# EAGLE design Plytka zasilacza (EAGLE 4.11)
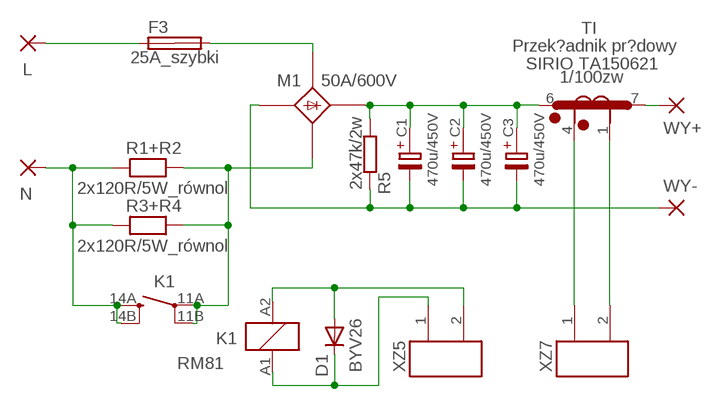
[diagram p0: schematic, sheet 1]

## Parts
C1  470u/450V  EB35D  [EB35D]
C2  470u/450V  EB35D  [EB35D]
C3  470u/450V  EB35D  [EB35D]
D1  BYV26  1N4148  [DO35-10]
F3  25A_szybki  SH32  [SH32]
K1  RM81  RP33  [RT-N/O16A5]
L  PAD-0820  [0820]
M1  50A/600V  B25A-  [B25A-]
N  PAD-0820  [0820]
R1+R2  2x120R/5W_równol  RPOWER5W  [RPOWER5W]
R3+R4  2x120R/5W_równol  RPOWER5W  [RPOWER5W]
R5  2x47k/2w  R-EU_0309/10  [0309/10]
TI  1/100zw  SIRIO  [SIRIO]
WY+  PAD-0820  [0820]
WY-  PAD  [25X5]
XZ5  ZK_2  [ZK_2]
XZ7  ZK_2  [ZK_2]

## Nets
N$1: D1.C K1.A1 XZ5.1
N$2: K1.14A(2:SA) K1.14B(2:SB) N.P$1(P) R1+R2.1 R3+R4.1
N$3: F3.2A M1.AC2-(AC2)
N$4: F3.1A L.P$1(P)
N$6: C1.+ C2.+ C3.+ M1.+1(+) R5.2 TI.6
N$7: C1.- C2.- C3.- M1.-1(-) R5.1 WY-.1(P)
N$8: TI.7 WY+.P$1(P)
N$9: D1.A K1.A2 XZ5.2
N$10: TI.4 XZ7.1
N$11: TI.1 XZ7.2
N$12: K1.11A(2:PA) K1.11B(2:PB) M1.AC1-(AC1) R1+R2.2 R3+R4.2
Unconnected: F3.1B F3.2B M1.+ M1.- M1.AC1 M1.AC2

## Notes on the sheet
- Przek?adnik pr?dowy
- SIRIO TA150621

## Library data of the parts
C1-C3 = elektrolity:EB35D
D1 = diode:1N4148: DIODE high speed (Philips)
F3 = fuse:SH32: FUSE HOLDER 6 x 32 mm, SH contact, SHH3N Schukat, 102071 Wickmann (Buerklin)
K1 = relay:RP?3*: Power PCB Relay RP II/1 SCHRACK 1 pole 16 A Source: http://www.schrack.com/.. 5834.pdf
L N WY+ WY- = dpads:PAD: WIRE PAD Standard US Drill Sizes and SMD pads
M1 = rectifier:B25A-: RECTIFIER 25-A bridge
R1+R2 R3+R4 = moje-elementy:RPOWER5W
R5 = rcl:R-EU_: RESISTOR, European symbol
TI = moje-elementy:SIRIO
XZ5 XZ7 = moje-elementy:ZK_2

## Board
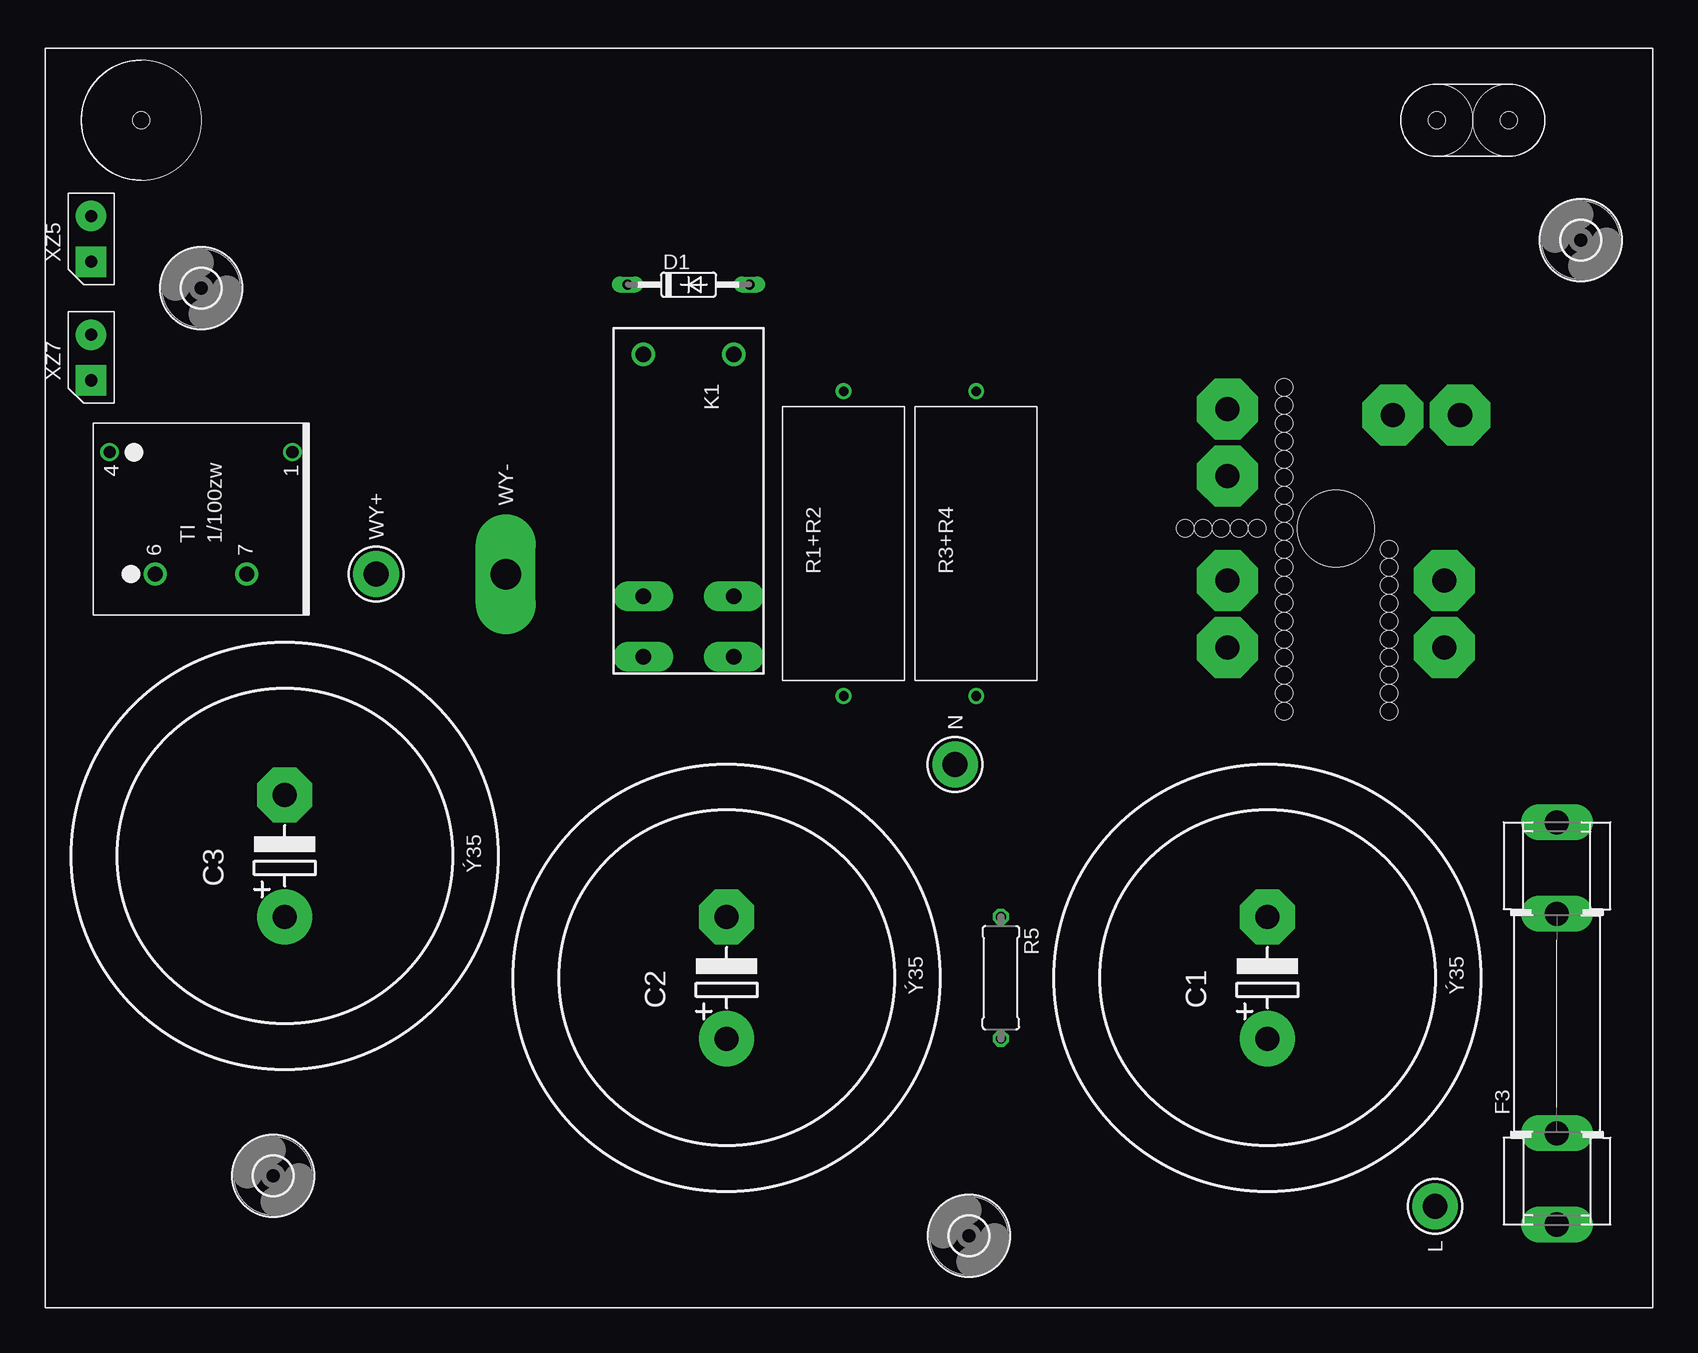
[diagram p1: board, top side]
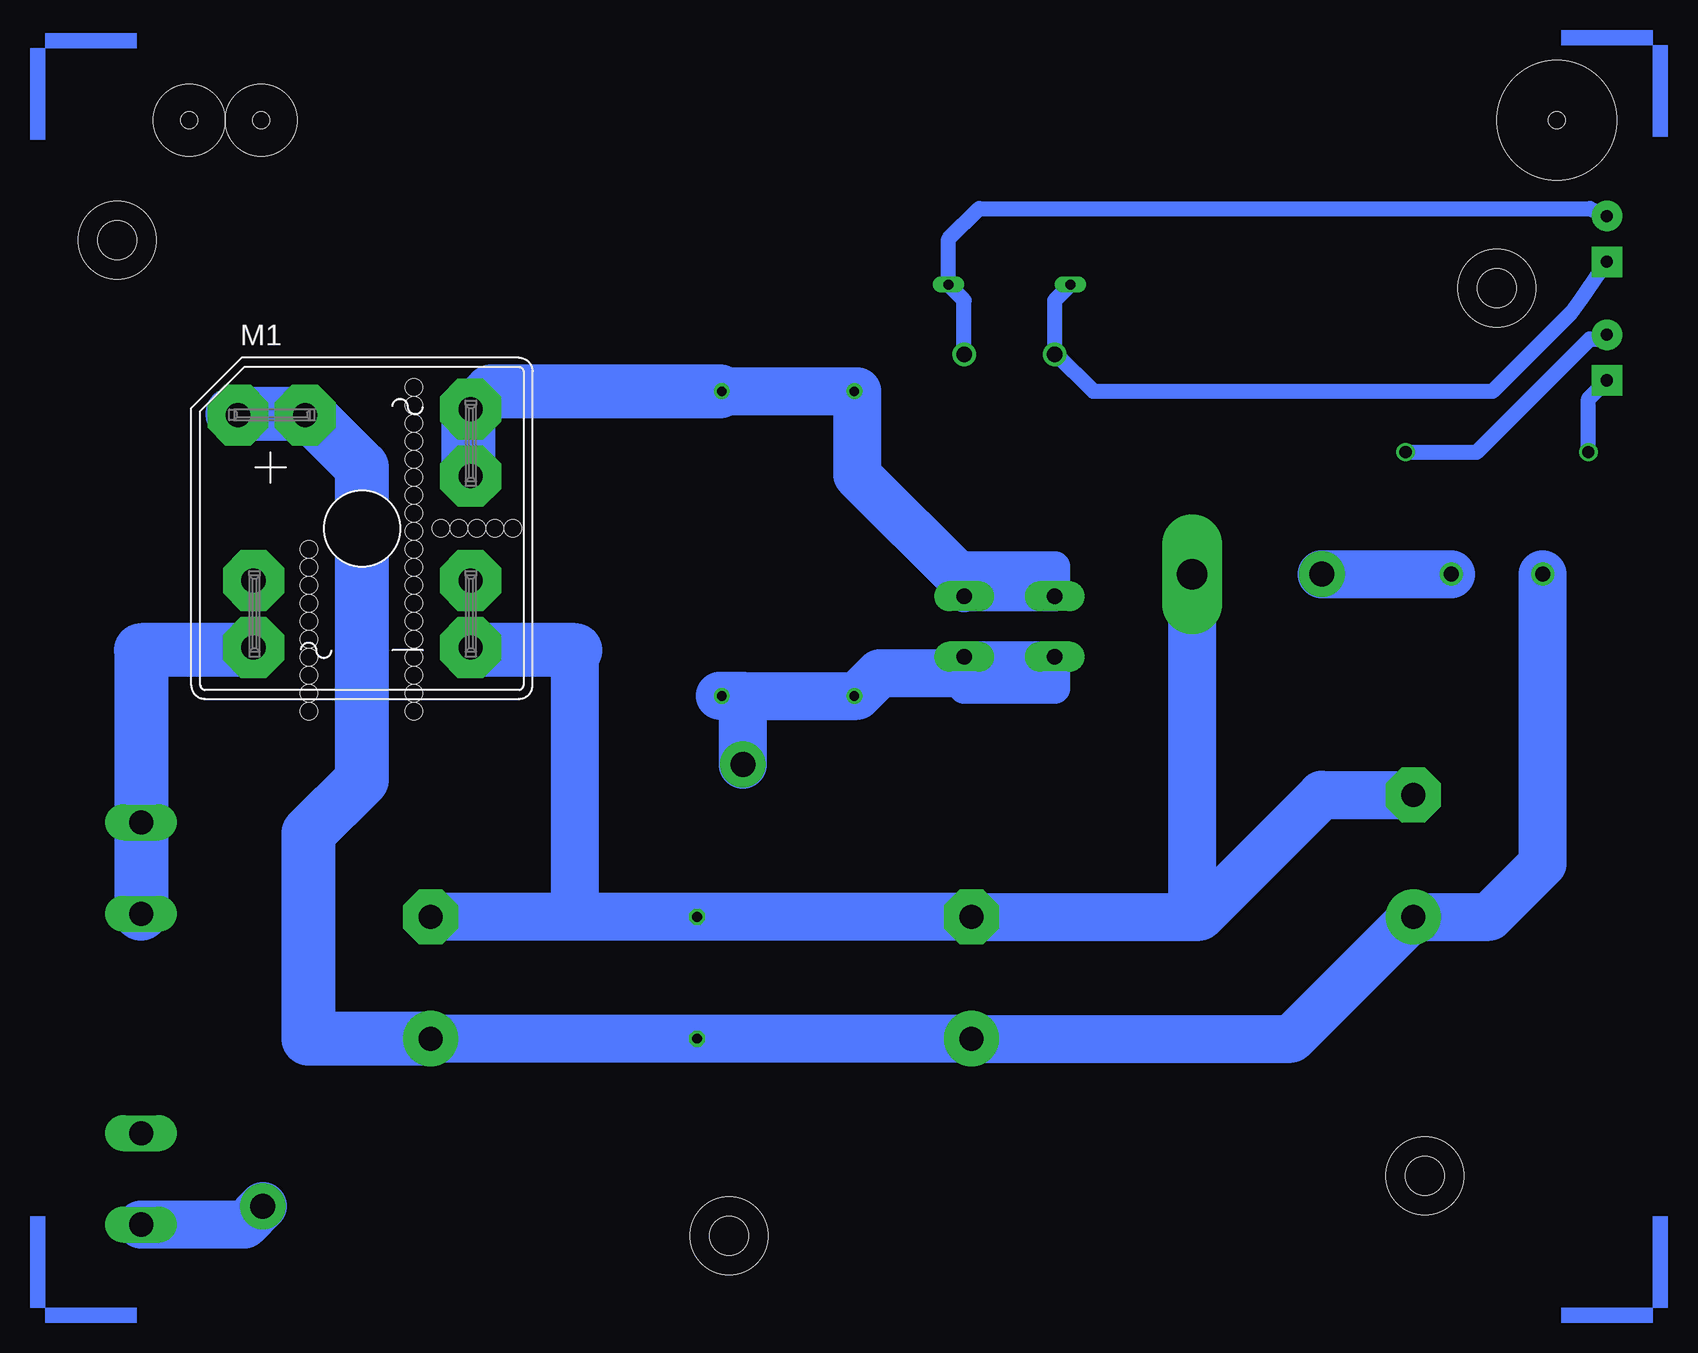
[diagram p2: board, bottom side, seen from below]

No outline drawn. Coordinates in mm, seen from the top.
Copper layers (1*16): Top 0.035mm / dielectric 1.5mm / Bottom 0.035mm
Design rules "default": minimum track width 10mil, minimum drill 24mil, track to track 8mil, track to pad 8mil, pad to pad 8mil, via to via 8mil, smd to smd 8mil, copper to edge 40mil, drill to drill 8mil, minimum pad ring 10mil, minimum via ring 8mil, stop-mask expansion 4mil, vias tented up to drill 0mil, thermal gap 10mil
Holes 6.45 mm at -6.27,-15.98 -57.27,-98.98 -115.27,-93.98 -121.27,-19.98
Holes 10 mm at -126.27,-5.98
Holes 1.42 mm at -126.27,-5.98 -18.27,-5.98 -12.27,-5.98 -31,-55.25 -31,-53.75 -31,-52.25 -31,-50.75 -31,-49.25 -31,-47.75 -31,-46.25 -31,-44.75 -31,-43.25 -31,-41.75 -31,-40.25 -31,-38.75 -31,-37.25 -31,-35.75 -31,-34.25 -31,-32.75 -31,-31.25 -31,-29.75 -31,-28.25 -22.25,-55.25 -22.25,-53.75 -22.25,-52.25 -22.25,-50.75 -22.25,-49.25 -22.25,-47.75 -22.25,-46.25 -22.25,-44.75 -22.25,-43.25 -22.25,-41.75 -39.25,-40 -37.75,-40 -36.25,-40 -34.75,-40 -33.25,-40
Holes 6 mm at -18.27,-5.98 -12.27,-5.98

### Footprints (pad centres in the part's own frame; a part is rotated, then mirrored left to right if it is on the bottom)
EB35D = drill 2.007 pad 4.597 round: + -5.08,0 | drill 2.007 pad 4.597 octagon: - 5.08,0
DO35-10 = drill 0.813 long: A 5.08,0; C -5.08,0
SH32 = drill 2.007 long: 1A -16.764,0; 1B -9.144,0; 2A 9.144,0; 2B 16.764,0
RT-N/O16A5 = drill 1.3 pad 2.5 long: 11A 7.56,3.78; 11B 7.56,-3.78; 14A 12.6,3.78; 14B 12.6,-3.78 | drill 1.3 round: A1 -12.6,-3.78; A2 -12.6,3.78
0820 = drill 2.083 pad 3.81 round: P$1 0,0
B25A- = drill 2.007 pad 5.08 octagon: + -10.338,9.449; +1 -4.75,9.449; - 9.042,-4.343; -1 9.042,-9.931; AC1 9.042,4.343; AC1- 9.042,9.931; AC2 -9.042,-4.343; AC2- -9.042,-9.931 | hole 6.401: 0,0
RPOWER5W = drill 0.813 round: 1 -12.7,0; 2 12.7,0
0309/10 = drill 0.813 octagon: 1 -5.08,0; 2 5.08,0
SIRIO = drill 1.016 round: 1 5.08,-7.62; 4 5.08,7.62 | drill 1.27 round: 6 -5.08,3.81; 7 -5.08,-3.81
3,2 = hole 3.2: 0,0
25X5 = drill 2.54 pad 5 long: 1 0,0
ZK_2 = drill 1.016 pad 2.54 square: 1 -3.81,0 | drill 1.016 pad 2.54 round: 2 0,0

### Placement (x,y rotation side)
C1  -32.38,-77.47 90 top
C2  -77.47,-77.47 90 top
C3  -114.3,-67.31 90 top
D1  -80.64,-19.68 0 top
F3  -8.26,-81.28 90 top
K1  -80.64,-38.1 270 top
L  -18.41,-96.52 270 top
M1  -26.67,-40.01 0 bottom
N  -58.42,-59.69 90 top
R1+R2  -67.72,-41.27 90 top
R3+R4  -56.67,-41.27 90 top
R5  -54.61,-77.47 270 top
TI  -121.28,-38.73 90 top
U$2  [3,2]  -115.27,-93.98 90 top
U$3  [3,2]  -57.27,-98.98 90 top
U$4  [3,2]  -6.27,-15.98 90 top
U$5  [3,2]  -121.27,-19.98 90 top
U$6  [ANGLE-ARROW-NW1]  -134.27,-104.98 90 top
U$7  [ANGLE-ARROW-NW1]  -134.27,0.27 0 top
U$8  [ANGLE-ARROW-NW1]  -0.27,0.02 270 top
U$9  [ANGLE-ARROW-NW1]  -0.27,-104.98 180 top
WY+  -106.68,-43.81 90 top
WY-  -95.89,-43.81 90 top
XZ5  -130.44,-13.97 90 top
XZ7  -130.44,-23.86 90 top

### Tracks (layer width: path | path; a pad name or v marks a point on that pad's centre or on a via)
N$1
  Bottom 1.27: K1.A1 -84.42,-25.4 | -84.42,-25.4 -84.42,-20.98 D1.C | XZ5.1 -128.27,-20.95 -127.52,-21.98 -120.92,-28.57 -87.63,-28.57 -84.45,-25.4 -84.42,-25.4
N$2
  Bottom 2.54: -76.86,-50.77 -76.83,-50.8 | -76.86,-50.77 K1.14A -76.86,-53.34 | K1.14B -76.94,-50.7 -76.86,-50.77 | -76.86,-53.34 -76.83,-53.34 | -76.86,-53.34 -84.45,-53.34 -84.45,-52.07 | -84.45,-52.07 -84.45,-50.8 | -76.83,-52.07 -84.45,-52.07
  Bottom 4: -76.83,-52.07 -69.85,-52.07 -67.94,-53.98 R1+R2.1 -58.42,-53.98 | -56.52,-53.98 R3+R4.1 -58.42,-53.98 | N.P$1 -58.42,-53.98
N$3
  Bottom 4.5: -17.78,-50.16 -17.63,-50.16 | -17.63,-50.16 M1.AC2- | F3.2A -8.26,-50.16 -17.63,-50.16
N$4
  Bottom 4: F3.1A -16.89,-98.04 L.P$1
N$6
  Bottom 4: C1.+ R5.2 C2.+ -104.14,-82.55 C3.+ -120.65,-72.39 -125.09,-67.94 TI.6
  Bottom 4.5: -21.92,-30.48 M1.+1 | -21.92,-30.48 -15.88,-30.48 | -21.92,-30.48 -22.23,-30.48 -26.67,-34.92 -26.67,-60.96 -22.23,-65.41 -22.23,-82.55 C1.+
N$7
  Bottom 4: -44.45,-72.39 R5.1 C2.- -95.89,-72.39 | -44.45,-72.39 C1.- | -95.89,-72.39 -96.52,-72.39 -106.68,-62.23 C3.- | -95.89,-72.39 WY-.1 | -44.45,-72.39 -44.45,-50.16
  Bottom 4.5: -35.71,-50.16 -35.56,-50.16 | -35.71,-50.16 M1.-1 | -44.45,-50.16 -35.71,-50.16
N$8
  Bottom 4: WY+.P$1 TI.7
N$9
  Bottom 1.27: K1.A2 -76.86,-20.98 D1.A -75.56,-15.88 -78.11,-13.34 -129.06,-13.34 XZ5.2
N$10
  Bottom 1.27: TI.4 -128.91,-29.21 XZ7.1
N$11
  Bottom 1.27: TI.1 -119.59,-33.66 -129.02,-24.23 -130.27,-24.23 -130.52,-23.98 -130.44,-23.91 XZ7.2
N$12
  Bottom 2.54: -76.86,-45.69 -76.83,-45.72 | -76.86,-45.69 K1.11A -76.86,-43.21 -76.83,-43.18 -84.45,-43.18 -84.45,-45.09 -77.47,-45.09 -76.83,-44.45 | K1.11B -76.89,-45.66 -76.86,-45.69
  Bottom 4: -76.83,-44.45 -67.94,-35.56 -67.94,-28.57 R1+R2.2 R3+R4.2 -56.52,-28.57
  Bottom 4.5: M1.AC1- -35.71,-29.84 -35.56,-29.84 -35.56,-30.48 | -35.56,-35.56 -35.56,-30.48 | -56.52,-28.57 -37.47,-28.57 -35.56,-30.48